# EAGLE design coffeere (EAGLE 9.4.1)
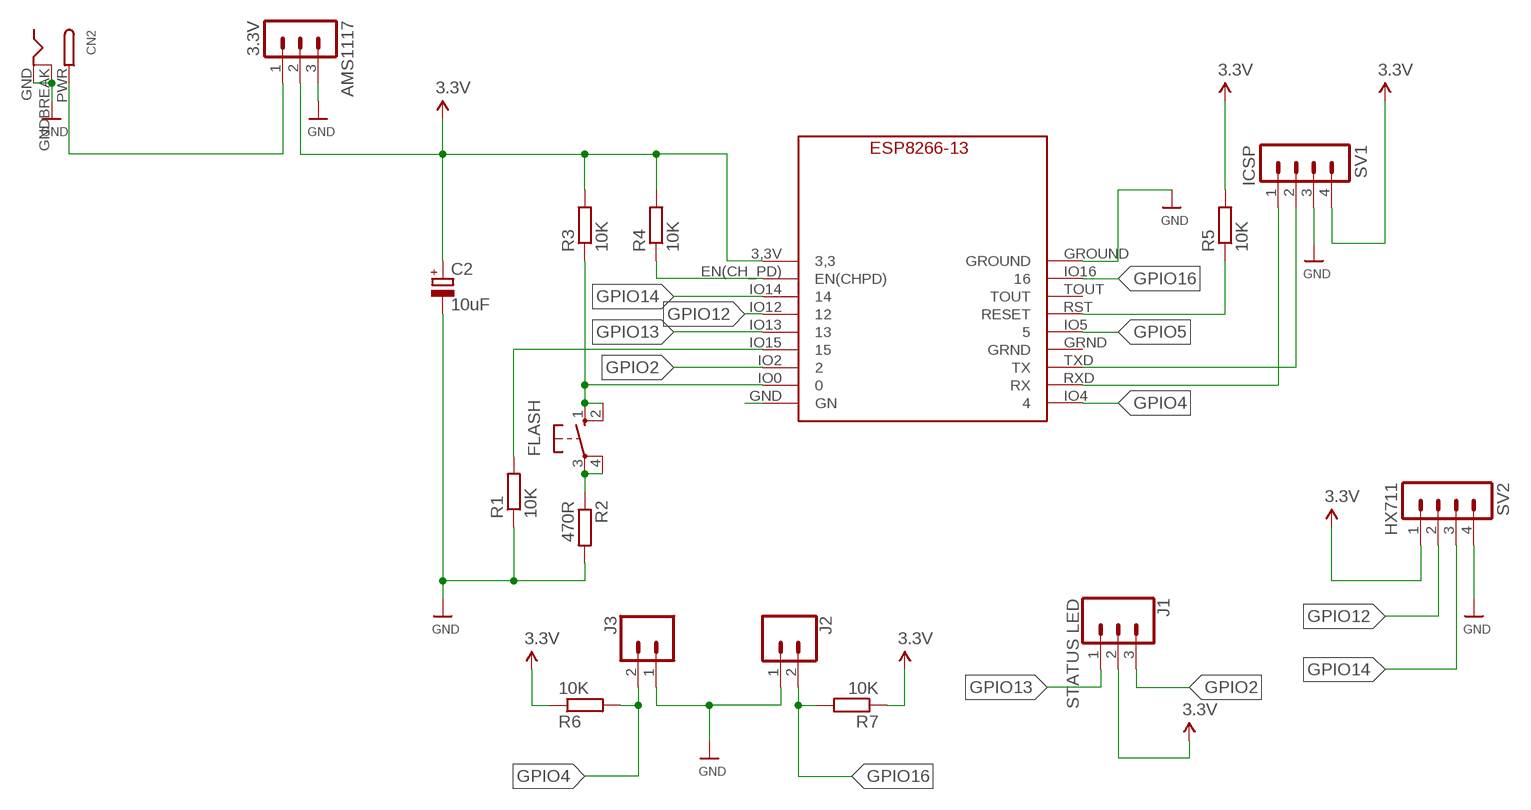
[diagram p0: schematic, sheet 1]

## Parts
AMS1117  3.3V  MA03-1  [MA03-1]
C2  10uF  CPOL-EUE2.5-6  [E2,5-6]
CN2  DCBARRELPTH  [DCJACK_2MM_PTH]
FLASH  10-XX  [B3F-10XX]
J1  STATUS LED  CONN_03  [1X03]
J2  CONN_02  [1X02]
J3  CONN_02  [1X02]
R1  10K  R-EU_0207/10  [0207/10]
R2  470R  R-EU_0207/10  [0207/10]
R3  10K  R-EU_0207/10  [0207/10]
R4  10K  R-EU_0207/10  [0207/10]
R5  10K  R-EU_0207/10  [0207/10]
R6  10K  R-EU_0207/10  [0207/10]
R7  10K  R-EU_0207/10  [0207/10]
SV1  ICSP  MA04-1  [MA04-1]
SV2  HX711  MA04-1  [MA04-1]
U$1  ESP8266-13  [ESP8266-13]

## Nets
3.3V: AMS1117.2 C2.+ J1.2 R3.2 R4.2 R5.2 R6.1 R7.1 SV1.4 SV2.1 U$1.3,3V(3,3)
GND: AMS1117.3 C2.- CN2.GND CN2.GNDBREAK J2.1 J3.1 R1.1 R2.2 SV1.3 SV2.4 U$1.GROUND
GPIO0: FLASH.1(S) FLASH.2(S1) R3.1 U$1.IO0
GPIO2: J1.3 U$1.IO2
GPIO4: J3.2 R6.2 U$1.IO4
GPIO5: U$1.IO5
GPIO12: SV2.2 U$1.IO12
GPIO13: J1.1 U$1.IO13
GPIO14: SV2.3 U$1.IO14
GPIO15: R1.2 U$1.IO15
GPIO16: J2.2 R7.2 U$1.IO16
N$2: AMS1117.1 CN2.PWR
N$12: SV1.2 U$1.TXD(TX)
N$13: SV1.1 U$1.RXD(RX)
N$14: U$1.GND(GN)
N$15: FLASH.3(P) FLASH.4(P1) R2.1
N$16: R5.1 U$1.RST(RESET)
N$17: R4.1 U$1.EN(CH_PD)(EN(CHPD))
Unconnected: U$1.GRND U$1.TOUT

## Library data of the parts
AMS1117 = con-lstb:MA03-1: PIN HEADER; OC_FARNELL: unknown; OC_NEWARK: unknown
C2 = rcl:CPOL-EU: POLARIZED CAPACITOR, European symbol; SPICEPREFIX: C
CN2 = adafruit:DCBARREL: 2.0mm DC Barrel Jack DCJACK_2MM_PTH - Through Hole Jack (4UConnector: 05537)
FLASH = switch-omron:10-XX: OMRON SWITCH; MPN: B3F-1000; OC_FARNELL: 176432; OC_NEWARK: 36M3542
J1 = SparkFun-Connectors:CONN_03: Multi connection point. Often used as Generic Header-pin footprint for 0.1 inch spaced/style header connections On any of the 0.1 inch spaced packages, you can populate with these: Break Away Headers - Straight <https://www.sparkfun.com/products/116> (PRT-00116) Break Away Male Headers - Right Angle <https://www.sparkfun.com/products/553> (PRT-00553) Female Headers <https://www.sparkfun.com/products/115> (PRT-00115) Break Away Headers - Machine Pin <https://www.sparkfun.com/products/117> (PRT-00117) Break Away Female Headers - Swiss Machine Pin <https://www.sparkfun.com/products/743> (PRT-00743) Stackable Header - 3 Pin (Female, 0.1") <https://www.sparkfun.com/products/13875> (PRT-13875) For SCREWTERMINALS and SPRING TERMINALS visit here: Screw Terimnals on SparkFun.com <https://www.sparkfun.com/search/results?term=Screw+Terminals> (5mm/3.5mm/2.54mm spacing) This device is also useful as a general connection point to wire up your design to another part of your project. Our various solder wires solder well into these plated through hole pads. Hook-Up Wire - Assortment (Stranded, 22 AWG) <https://www.sparkfun.com/products/11375> (PRT-11375) Hook-Up Wire - Assortment (Solid Core, 22 AWG) <https://www.sparkfun.com/products/11367> (PRT-11367) View the entire wire category on our website here <https://www.sparkfun.com/categories/141> Special notes: Molex polarized connector foot print use with SKU : PRT-08232 with associated crimp pins and housings.; PROD_ID: XXX-00000; VALUE: 455-1750-1-ND
J2 J3 = SparkFun-Connectors:CONN_02: Multi connection point. Often used as Generic Header-pin footprint for 0.1 inch spaced/style header connections On any of the 0.1 inch spaced packages, you can populate with these: Break Away Headers - Straight <https://www.sparkfun.com/products/116> (PRT-00116) Break Away Male Headers - Right Angle <https://www.sparkfun.com/products/553> (PRT-00553) Female Headers <https://www.sparkfun.com/products/115> (PRT-00115) Break Away Headers - Machine Pin <https://www.sparkfun.com/products/117> (PRT-00117) Break Away Female Headers - Swiss Machine Pin <https://www.sparkfun.com/products/743> (PRT-00743) For SCREWTERMINALS and SPRING TERMINALS visit here: Screw Terimnals on SparkFun.com <https://www.sparkfun.com/search/results?term=Screw+Terminals> (5mm/3.5mm/2.54mm spacing) This device is also useful as a general connection point to wire up your design to another part of your project. Our various solder wires solder well into these plated through hole pads. Hook-Up Wire - Assortment (Stranded, 22 AWG) <https://www.sparkfun.com/products/11375> (PRT-11375) Hook-Up Wire - Assortment (Solid Core, 22 AWG) <https://www.sparkfun.com/products/11367> (PRT-11367) View the entire wire category on our website here <https://www.sparkfun.com/categories/141> Special notes: Molex polarized connector foot print use with: PRT-08233 with associated crimp pins and housings. 2.54_SCREWTERM for use with PRT-10571. 3.5mm Screw Terminal footprints for PRT-08084 5mm Screw Terminal footprints for use with PRT-08432
R1-R7 = rcl:R-EU_: RESISTOR, European symbol; SPICEPREFIX: 4700R
SV1 SV2 = con-lstb:MA04-1: PIN HEADER; OC_FARNELL: unknown; OC_NEWARK: unknown
U$1 = ESP8266-13:ESP8266-13: ESP8266-13

## Board
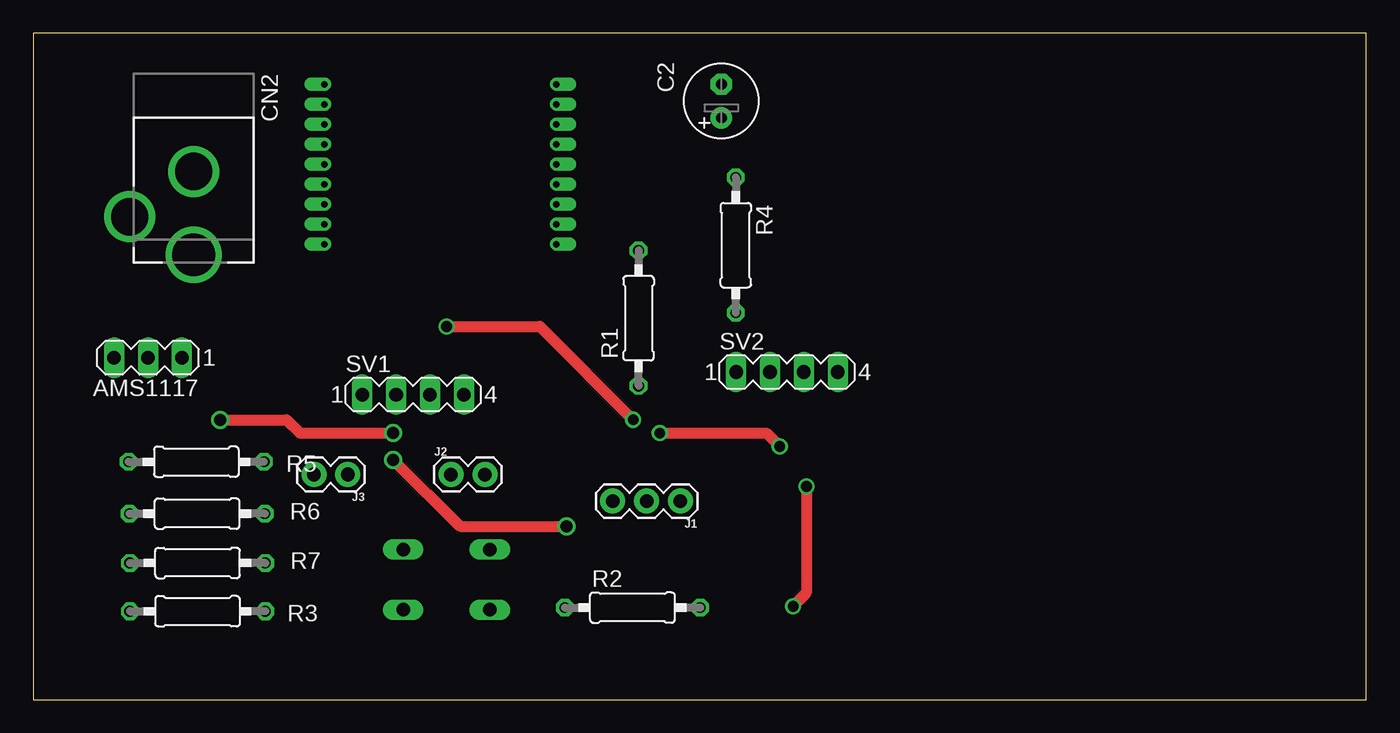
[diagram p1: board, top side]
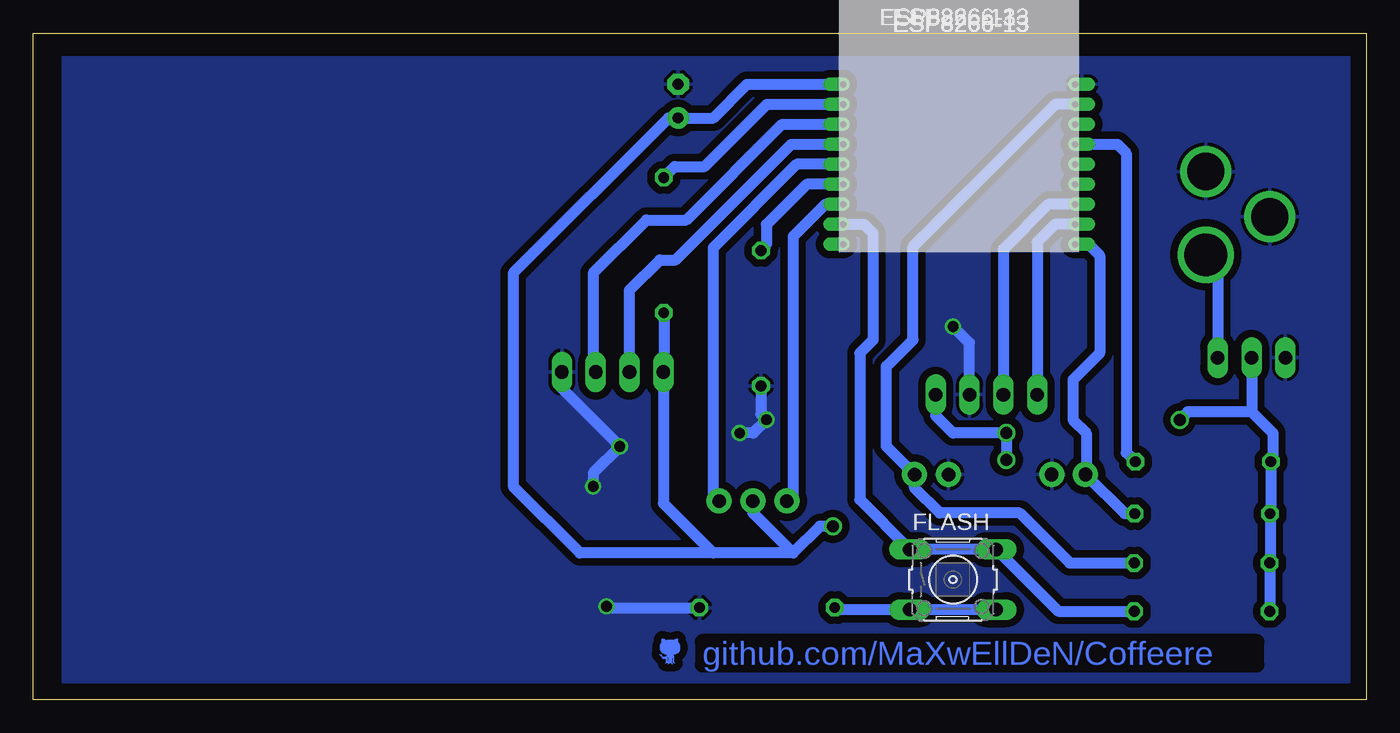
[diagram p2: board, bottom side, seen from below]

Size 100 x 50 mm. Coordinates in mm from the lower left corner, seen from the top.
Outline: 0,0 100,0 100,50 0,50 0,0
Copper layers (1*16): Top 0.035mm / dielectric 1.5mm / Bottom 0.035mm
Design rules "default *": minimum track width 6mil, minimum drill 0.35mm, track to track 6mil, track to pad 6mil, pad to pad 6mil, via to via 6mil, smd to smd 6mil, copper to edge 40mil, drill to drill 6mil, minimum pad ring 10mil, minimum via ring 8mil, stop-mask expansion 4mil, vias tented up to drill 0mil, thermal gap 10mil

### Footprints (pad centres in the part's own frame; a part is rotated, then mirrored left to right if it is on the bottom)
MA03-1 = drill 1.016 long: 1 -2.54,0; 2 0,0; 3 2.54,0
E2,5-6 = drill 0.813 pad 1.6: + -1.27,0 | drill 0.813 pad 1.6 octagon: - 1.27,0
DCJACK_2MM_PTH = drill 2.8: GND 0,7.35; GNDBREAK 4.8,10.75 | drill 3.2: PWR 0,13.6
B3F-10XX = drill 1.016 long: 1 -3.251,2.261; 2 3.251,2.261; 3 -3.251,-2.261; 4 3.251,-2.261
1X03 = drill 1.016 pad 1.88: 1 0,0; 2 2.54,0; 3 5.08,0
1X02 = drill 1.016 pad 1.88: 1 0,0; 2 2.54,0
0207/10 = drill 0.813 octagon: 1 -5.08,0; 2 5.08,0
MA04-1 = drill 1.016 long: 1 -3.81,0; 2 -1.27,0; 3 1.27,0; 4 3.81,0
ESP8266-13 = drill 0.5 offset: 3,3V -7.7,3.1; EN(CH_PD) -7.7,1.6; GND -7.7,-8.9; GRND 9.7,-4.4; GROUND 9.7,3.1; IO0 -7.7,-7.4; IO2 -7.7,-5.9; IO4 9.7,-8.9; IO5 9.7,-2.9; IO12 -7.7,-1.4; IO13 -7.7,-2.9; IO14 -7.7,0.1; IO15 -7.7,-4.4; IO16 9.7,1.6; RST 9.7,-1.4; RXD 9.7,-7.4; TOUT 9.7,0.1; TXD 9.7,-5.9

### Placement (x,y rotation side)
AMS1117  8.6,25.66 180 top
C2  51.62,44.91 90 top
CN2  12.03,46.98 180 top
FLASH  31,9 0 bottom
J1  48.55,14.89 180 top
J2  31.34,16.89 0 top
J3  23.59,16.89 180 top
R1  45.41,28.62 90 top
R2  44.95,6.9 0 top
R3  12.32,6.62 180 top
R4  52.7,34.1 270 top
R5  12.23,17.84 180 top
R6  12.29,13.95 0 top
R7  12.32,10.25 0 top
SV1  28.49,22.89 0 top
SV2  56.54,24.58 0 top
U$1  31.54,43.07 0 bottom

### Tracks (layer width: path | path; a pad name or v marks a point on that pad's centre or on a via)
3.3V  (via drill 0.9)
  Top 0.813: v14,21 19,21 20,20 v27,20 | v27,18 32,13 v40,13
  Bottom 0.813: AMS1117.2 8.6,21.6 | 8.6,21.6 7,20 7,18 R5.2 7.15,14.01 R6.1 7.21,10.28 R7.1 R3.2 | 8.6,21.6 13.4,21.6 v14,21 | SV1.4 32.3,21.3 31,20 v27,20 v27,18 | R4.2 52.7,24.61 SV2.1 52.73,14.73 49,11 | U$1.3,3V 46.46,46.17 48.98,43.65 C2.+ 52.35,43.65 64,32 64,16 59,11 49,11 | v40,13 41,13 43,11 | 43,11 49,11 | J1.2 46.01,14.01 43,11
GND  (via drill 0.8)
  Top 0.813: v31,28 38,28 v45,21 | v47,20 55,20 v56,19 | v58,16 58,8 v57,7
  Bottom 0.813: SV1.3 29.76,26.76 v31,28 | R1.1 45.41,21.41 v45,21 46,20 v47,20 | SV2.4 60.35,23.35 v56,19 58,17 v58,16 | v57,7 56.9,6.9 R2.2
  pour Bottom (isolate 0.559, rank 2): 1.27,1.27 97.79,1.27 97.79,48.26 1.27,48.26
GPIO0
  Bottom 0.813: R3.1 23.11,6.62 FLASH.2 FLASH.1 38,15.01 38,26 37,27 37,35 37.67,35.67 U$1.IO0
GPIO2
  Bottom 0.813: J1.3 43,15.36 43,34.76 40.59,37.17 U$1.IO2
GPIO4
  Bottom 0.813: U$1.IO4 20.84,34.17 20,33.33 20,26 22,24 22,21 21,20 21,16.95 J3.2 18.11,13.95 R6.2
GPIO12
  Bottom 0.813: U$1.IO12 43.13,41.67 51.8,33 53,33 55.27,30.73 SV2.2
GPIO13
  Bottom 0.813: J1.1 49,15.34 49,33.9 42.73,40.17 U$1.IO13
GPIO14
  Bottom 0.813: SV2.3 58,24.77 58,32 54,36 51,36 43.83,43.17 U$1.IO14
GPIO15
  Bottom 0.813: U$1.IO15 41.98,38.67 45,35.65 45,34.11 R1.2
GPIO16
  Bottom 0.813: R7.2 22.25,10.25 26,14 32,14 33.88,15.88 J2.2 36,19.01 36,25 34,27 34,34 23.33,44.67 U$1.IO16
N$2
  Bottom 0.813: CN2.PWR 11.14,32.49 AMS1117.1
N$12
  Bottom 0.813: U$1.TXD 23.83,37.17 27.22,33.78 SV1.2
N$13
  Bottom 0.813: U$1.RXD 23.33,35.67 24.68,34.32 SV1.1
N$15
  Bottom 0.813: FLASH.4 FLASH.3 39.71,6.74 R2.1
N$16
  Bottom 0.813: R5.1 18,18.53 18,41 18.67,41.67 U$1.RST
N$17
  Bottom 0.813: U$1.EN(CH_PD) 44.97,44.67 49.64,40 51.88,40 R4.1
(copper drawn outside any net)
  shapes: Bottom area x127

### Text on the board
Bottom: github.com/MaXwEllDeN/Coffeere